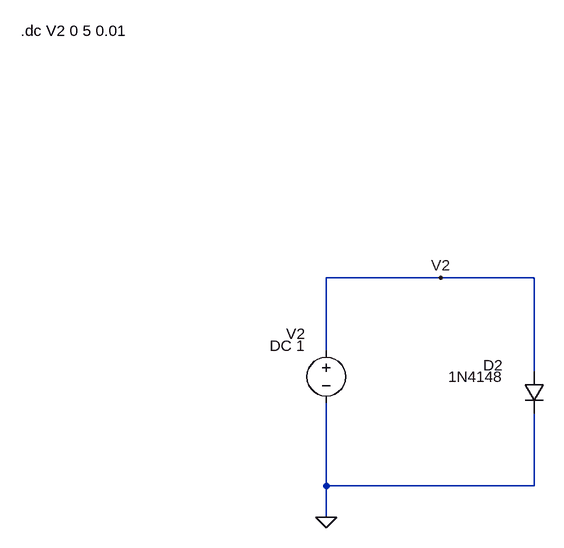
[diagram p0: schematic 2_1_1_Diodenkennlinie.asc]
2_1_1_Diodenkennlinie.asc, the LTspice schematic file:
Version 4
SHEET 1 880 680
WIRE 480 848 480 800
WIRE 480 800 480 688
WIRE 480 688 480 672
WIRE 480 800 800 800
WIRE 800 800 800 720
WIRE 800 720 800 688
WIRE 480 592 480 480
WIRE 480 480 800 480
WIRE 800 480 800 624
FLAG 480 848 0
FLAG 656 480 V2
SYMBOL voltage 480 576 R0
WINDOW 0 -32 -10 Right 2
WINDOW 3 -32 8 Right 2
SYMATTR InstName V2
SYMATTR Value DC 1
SYMBOL diode 784 624 R0
WINDOW 0 -32 -10 Right 2
WINDOW 3 -32 8 Right 2
SYMATTR InstName D2
SYMATTR Value 1N4148
TEXT 10 100 Left 2 !.dc V2 0 5 0.01

The netlist it stands for:
* 2_1_1_Diodenkennlinie.asc
V2 V2 0 DC 1
D2 V2 0 1N4148
.model D D
.lib standard.dio
.dc V2 0 5 0.01
.backanno
.end